# EAGLE design Double Socket (EAGLE 7.4.0)
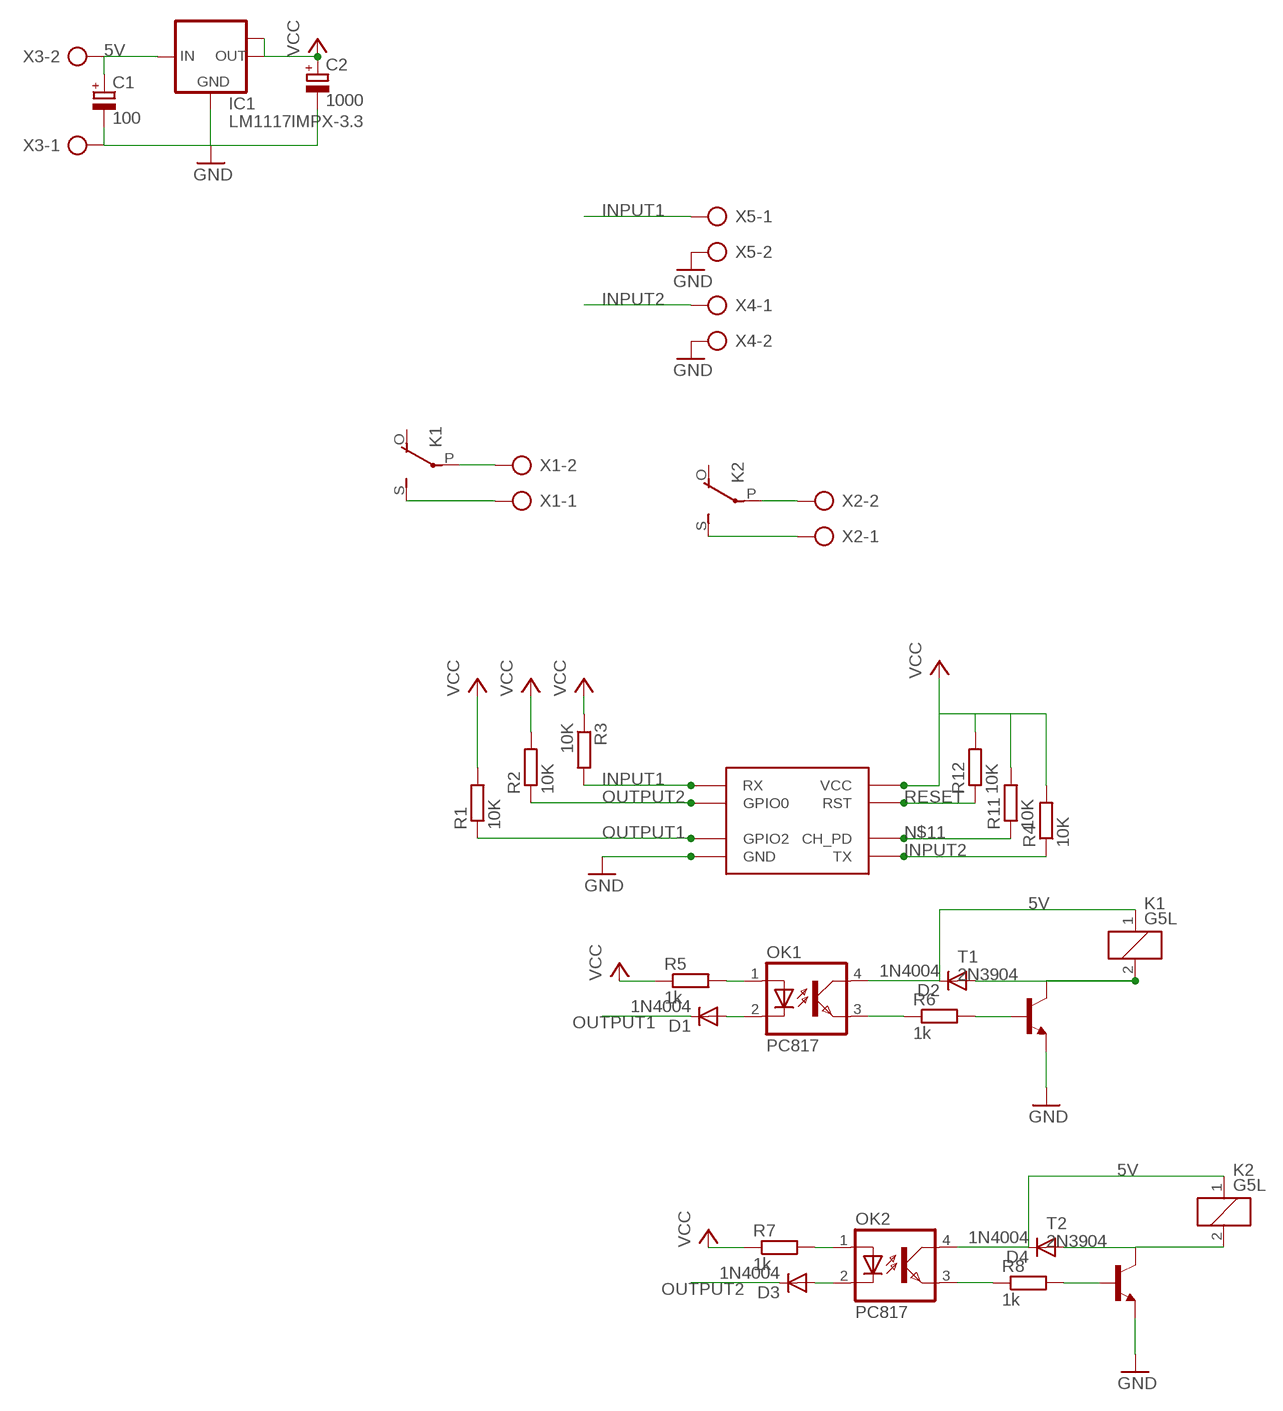
[diagram p0: schematic, sheet 1]

## Parts
C1  100  CPOL-EUE5-10.5  [E5-10,5]
C2  1000  CPOL-EUE5-10.5  [E5-10,5]
D1  1N4004  [DO41-10]
D2  1N4004  [DO41-10]
D3  1N4004  [DO41-10]
D4  1N4004  [DO41-10]
IC1  LM1117IMPX-3.3  [SOT223]
K1  G5L  [G5LE]
K2  G5L  [G5LE]
OK1  PC817  [DIL04]
OK2  PC817  [DIL04]
R1  10K  R-EU_M0805  [M0805]
R2  10K  R-EU_M0805  [M0805]
R3  10K  R-EU_M0805  [M0805]
R4  10K  R-EU_M0805  [M0805]
R5  1k  R-EU_M0805  [M0805]
R6  1k  R-EU_M0805  [M0805]
R7  1k  R-EU_M0805  [M0805]
R8  1k  R-EU_M0805  [M0805]
R11  10K  R-EU_M0805  [M0805]
R12  10K  R-EU_M0805  [M0805]
T1  2N3904  [TO92]
T2  2N3904  [TO92]
U$2  ESP8266  [ESP8266]
X1  AK500/2-H  [AK500/2-H]
X2  AK500/2-H  [AK500/2-H]
X3  AK500/2-H  [AK500/2-H]
X4  AK500/2-H  [AK500/2-H]
X5  AK500/2-H  [AK500/2-H]

## Nets
5V: C1.+ D2.C D4.C IC1.3(IN) K1.1 K2.1 OK1.4(COL) OK2.4(COL) X3.2
GND: C1.- C2.- IC1.1(GND) T1.3(E) T2.3(E) U$2.GND X3.1 X4.2 X5.2
INPUT1: R3.2 U$2.RX X5.1
INPUT2: R4.1 U$2.TX X4.1
N$1: K1.P(2:P) X1.2
N$2: K1.S(2:S) X1.1
N$3: OK1.1(A) R5.2
N$4: OK1.3(EMIT) R6.1
N$5: D1.A OK1.2(C)
N$6: OK2.1(A) R7.2
N$7: R6.2 T1.2(B)
N$8: D2.A K1.2 T1.1(C)
N$9: OK2.3(EMIT) R8.1
N$10: D3.A OK2.2(C)
N$11: R11.1 U$2.CH_PD
N$12: R8.2 T2.2(B)
N$13: D4.A K2.2 T2.1(C)
N$14: K2.S(2:S) X2.1
N$15: K2.P(2:P) X2.2
OUTPUT1: D1.C R1.1 U$2.GPIO2
OUTPUT2: D3.C R2.1 U$2.GPIO0
RESET: R12.1 U$2.RST
VCC: C2.+ IC1.2(OUT) IC1.TAB(OUT1) R1.2 R2.2 R3.1 R4.2 R5.1 R7.1 R11.2 R12.2 U$2.VCC
Unconnected: K1.O(2:O) K2.O(2:O)

## Library data of the parts
C1 C2 = rcl:CPOL-EU: POLARIZED CAPACITOR, European symbol
D1-D4 = diode:1N4004: DIODE general purpose rectifier, 1 A
IC1 = lm1117:LM1117IMPX-*
K1 K2 = relay:G5L: RELAY 1 x switch, 10 A/120 V AC, 8 A/30 V ADC, Omron; OC_FARNELL: unknown; OC_NEWARK: unknown
OK1 OK2 = optocoupler:PC817: SHARP OPTO COUPLER; MPN: PC817X4J000F; OC_FARNELL: 9707727; OC_NEWARK: 97K7059
R1-R8 R11 R12 = rcl:R-EU_: RESISTOR, European symbol
T1 T2 = transistor:2N3904: NPN TRANSISTOR
U$2 = Andre:ESP8266
X1-X5 = con-ptr500:AK500/2-H: CONNECTOR Aug. 2004 / PTR Meßtechnik: Die Bezeichnung der Serie AK505 wurde geändert. Es handelt sich hierbei um AK500 in horizontaler Ausführung.

## Board
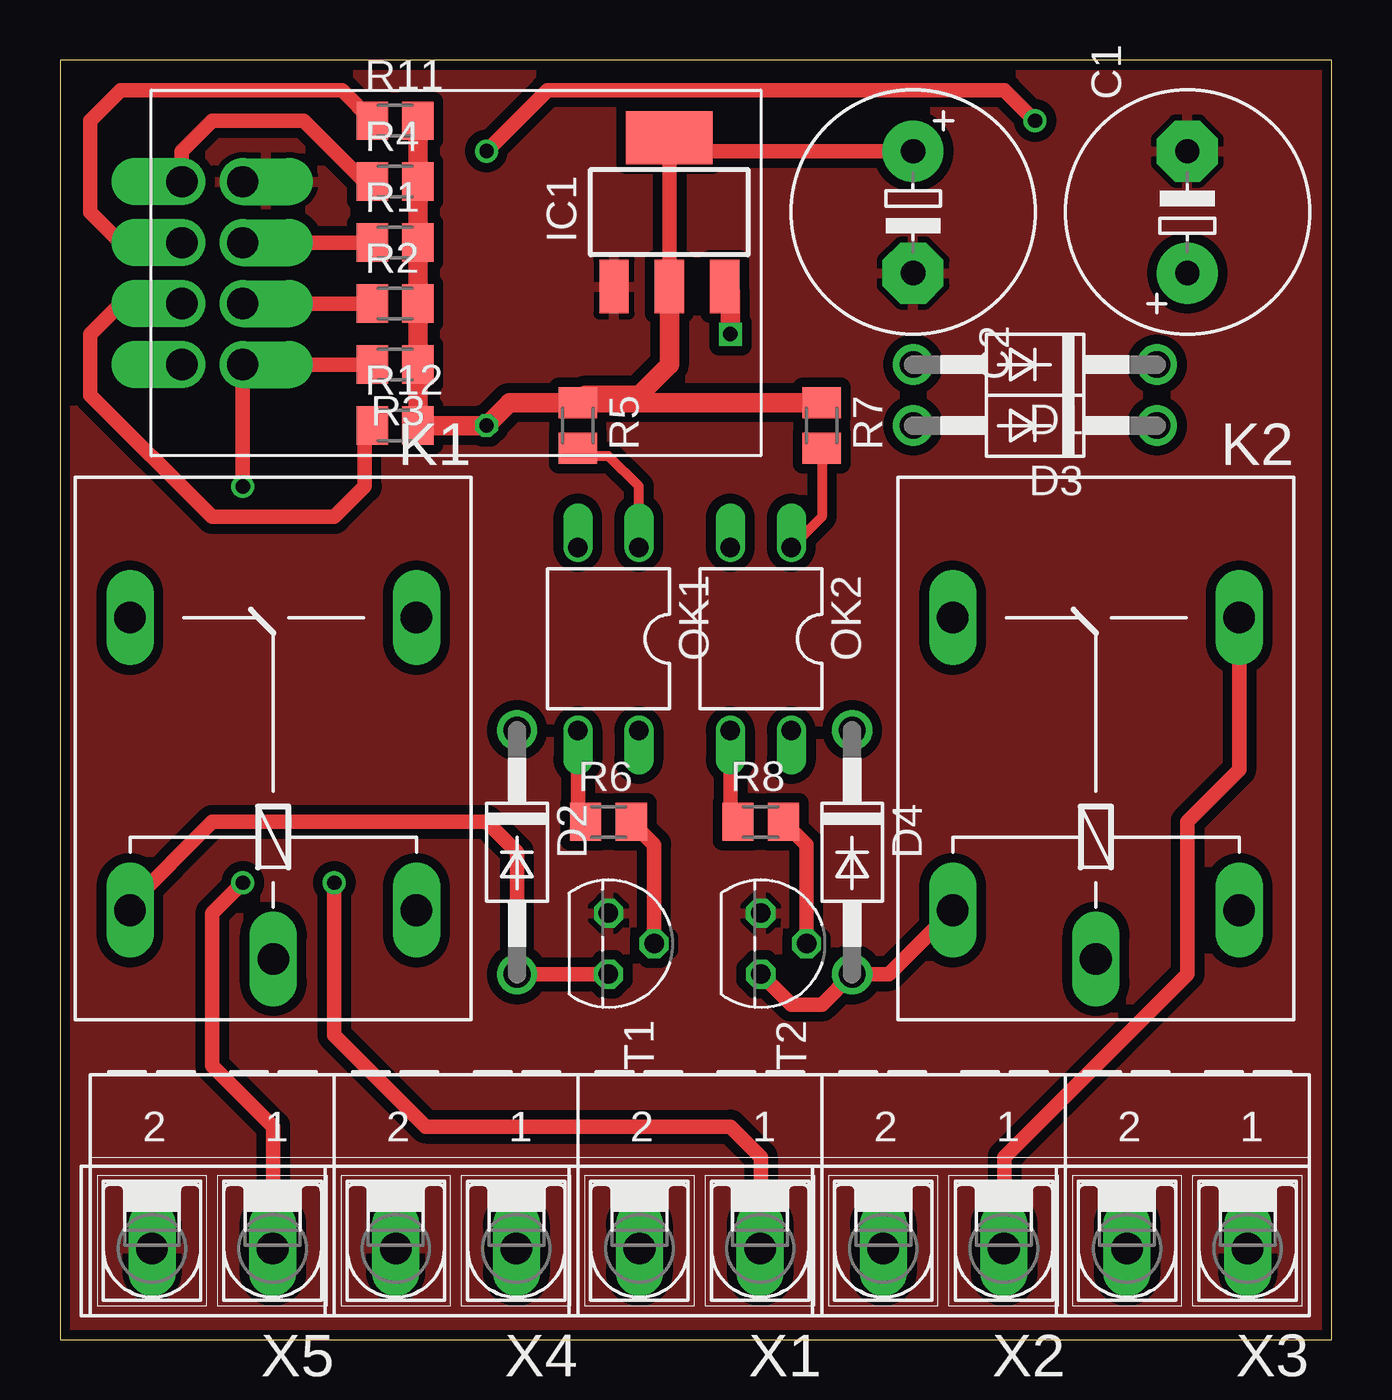
[diagram p1: board, top side]
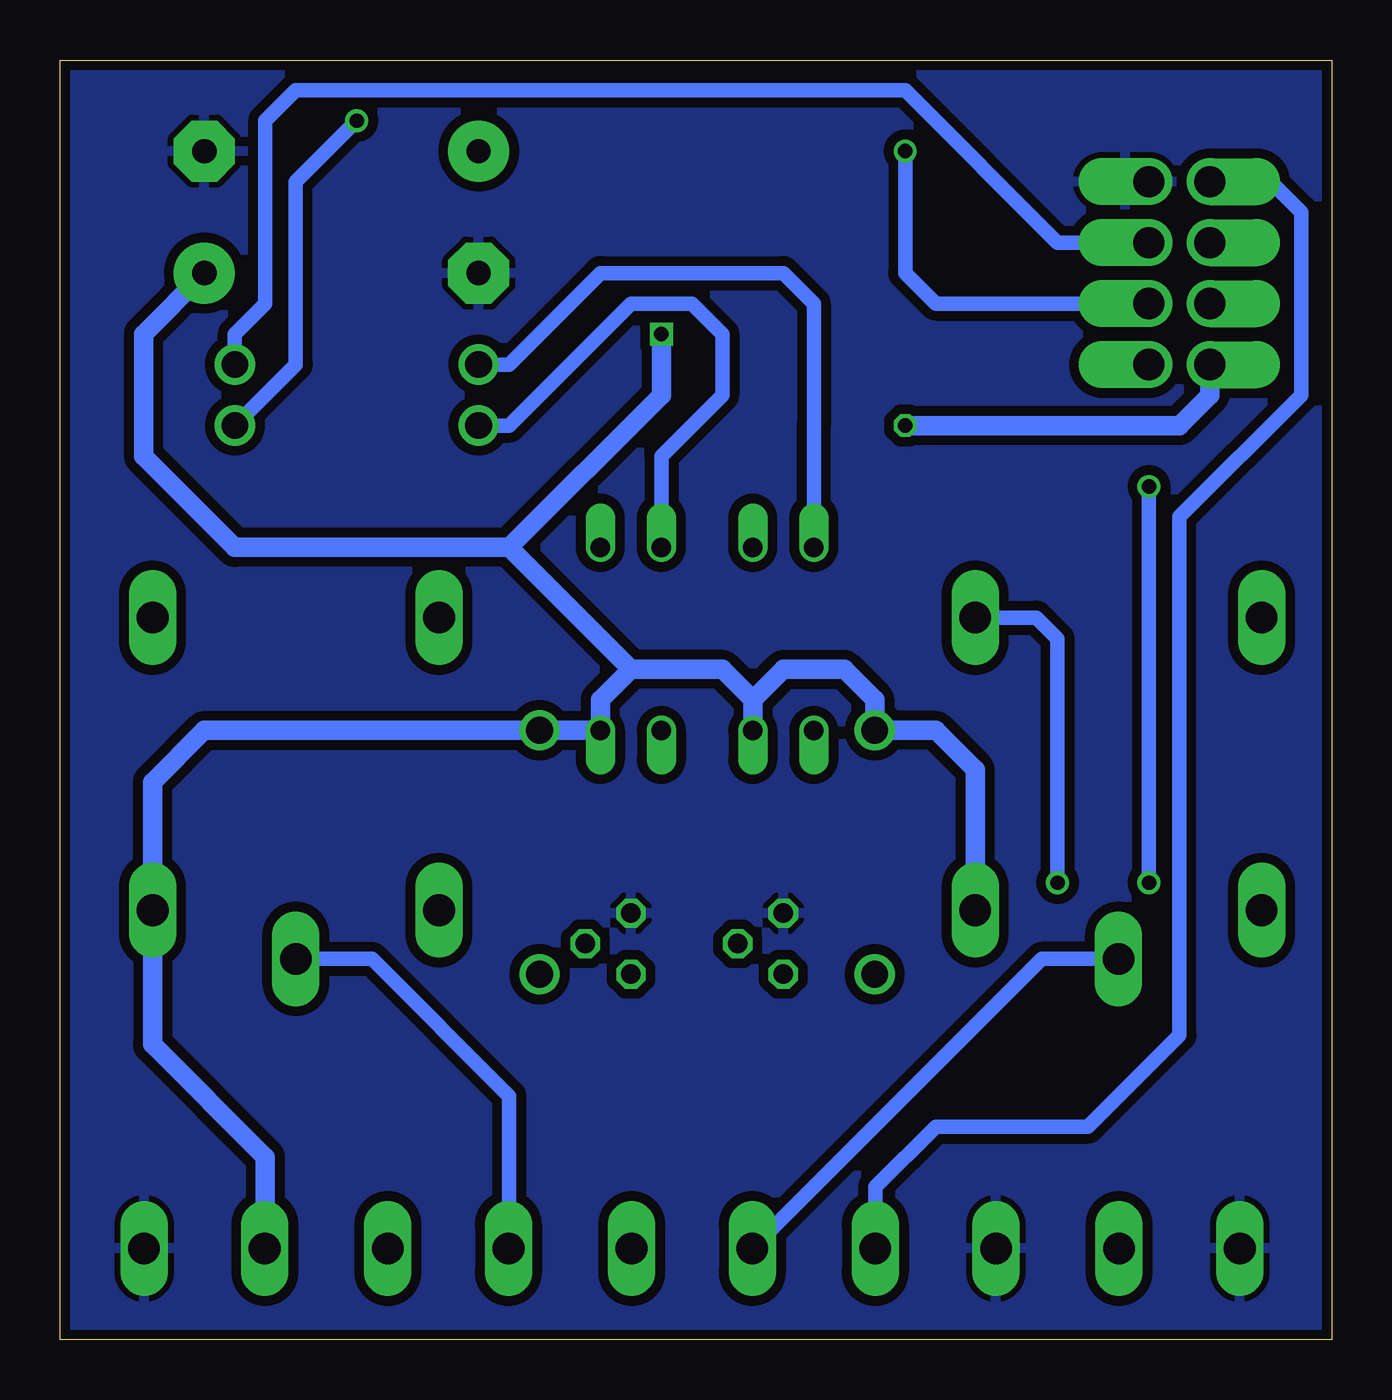
[diagram p2: board, bottom side, seen from below]

Size 53.01 x 53.33 mm. Coordinates in mm from the lower left corner, seen from the top.
Outline: 0,0 53.01,0 53.01,53.33 0,53.33 0,0
Copper layers (1*16): Top 0.0356mm / dielectric 1.5011mm / Bottom 0.0356mm
Design rules "oshpark-2layer": minimum track width 6mil, minimum drill 13mil, track to track 6mil, track to pad 6mil, pad to pad 6mil, via to via 6mil, smd to smd 6mil, copper to edge 15mil, drill to drill 6mil, minimum pad ring 7mil, minimum via ring 7mil, stop-mask expansion 2.5mil, vias tented up to drill 0mil, thermal gap 10mil

### Footprints (pad centres in the part's own frame; a part is rotated, then mirrored left to right if it is on the bottom)
E5-10,5 = drill 1.016 pad 2.54: + -2.54,0 | drill 1.016 pad 2.54 octagon: - 2.54,0
DO41-10 = drill 1.118: A 5.08,0; C -5.08,0
SOT223 = smd 1.219 x 2.235: 1 -2.311,-3.099; 2 0,-3.099; 3 2.311,-3.099 | smd 3.6 x 2.2: TAB 0,3.099
G5LE = drill 1.321 long: 1 -7.493,-5.969; 2 -7.493,5.969; O 4.699,5.969; P -9.525,0; S 4.699,-5.969
DIL04 = drill 0.813 offset: 1 -1.27,-3.81; 2 1.27,-3.81; 3 1.27,3.81; 4 -1.27,3.81
M0805 = smd 1.3 x 1.6: 1 -0.95,0; 2 0.95,0
TO92 = drill 0.813 octagon: 1 1.27,0; 2 0,1.905; 3 -1.27,0
ESP8266 = drill 1.3 offset: CH_PD -1.27,-11.43; GND -3.81,-8.89; GPIO0 1.27,-8.89; GPIO2 -1.27,-8.89; RST 1.27,-11.43; RX 3.81,-8.89; TX -3.81,-11.43; VCC 3.81,-11.43
AK500/2-H = drill 1.321 long: 1 -2.515,0; 2 2.515,0

### Placement (x,y rotation side)
C1  46.99,46.99 90 top
C2  35.56,46.99 270 top
D1  40.64,40.64 180 top
D2  19.05,20.32 270 top
D3  40.64,38.1 180 top
D4  33.02,20.32 270 top
IC1  25.4,46.99 0 top
K1  8.89,25.4 90 top
K2  43.18,25.4 90 top
OK1  22.86,29.21 180 top
OK2  29.21,29.21 180 top
R1  13.97,45.72 0 top
R2  13.97,43.18 0 top
R3  13.97,40.64 180 top
R4  13.97,48.26 0 top
R5  21.59,38.1 270 top
R6  22.86,21.59 0 top
R7  31.75,38.1 270 top
R8  29.21,21.59 0 top
R11  13.97,50.8 0 top
R12  13.97,38.1 0 top
T1  22.86,16.51 270 top
T2  29.21,16.51 270 top
U$2  16.51,44.45 270 top
X1  26.67,3.81 180 top
X2  36.83,3.81 180 top
X3  46.99,3.81 180 top
X4  16.51,3.81 180 top
X5  6.35,3.81 180 top

### Tracks (layer width: path | path; a pad name or v marks a point on that pad's centre or on a via)
5V  (via drill 0.6)
  Top 0.813: v27.94,41.91 27.94,43.66 IC1.3
  Bottom 0.813: X3.2 44.45,3.83 44.45,7.62 49.15,12.32 K2.1 49.15,23.24 46.99,25.4 D4.C OK2.4 30.48,26.67 29.21,27.94 | 24.13,26.67 OK1.4 | 24.13,26.67 25.4,27.94 29.21,27.94 | 24.13,26.67 22.86,27.94 20.32,27.94 19.05,26.67 D2.C 16.51,25.4 14.86,23.75 K1.1 | 29.21,27.94 34.29,33.02 | 34.29,33.02 27.94,39.37 v27.94,41.91 | 34.29,33.02 45.72,33.02 49.53,36.83 49.53,41.91 C1.+
GND
  pour Bottom (isolate 0.406): 0,0 53.34,0 53.34,53.34 0,53.34
  pour Top (isolate 0.406): 0,0 53.34,0 53.34,53.34 0,53.34
INPUT1  (via drill 0.6)
  Top 0.61: R3.2 U$2.RX v7.62,35.56 | v7.62,19.05 6.35,17.78 6.35,11.43 8.89,8.89 8.89,3.83 X5.1
  Bottom 0.61: v7.62,35.56 v7.62,19.05
INPUT2
  Top 0.61: U$2.TX 5.08,49.53 6.35,50.8 10.16,50.8 12.7,48.26 R4.1
  Bottom 0.61: X4.1 19.02,6.38 16.51,8.89 10.16,8.89 6.35,12.7 6.35,34.29 1.27,39.37 1.27,46.99 2.54,48.26 U$2.TX
N$1
  Bottom 0.61: K1.P 12.09,15.88 X1.2
N$2  (via drill 0.6)
  Top 0.61: v11.43,19.05 11.43,12.7 15.24,8.89 27.94,8.89 29.21,7.62 29.21,3.83 X1.1
  Bottom 0.61: K1.S 12.32,30.1 11.43,29.21 v11.43,19.05
N$3
  Top 0.406: OK1.1 24.13,35.56 22.86,36.83 21.91,36.83 R5.2
N$4
  Top 0.61: OK1.3 21.59,21.91 R6.1
N$5
  Bottom 0.61: OK1.2 21.59,36.83 21.59,38.1 21.59,43.18 22.86,44.45 30.48,44.45 34.29,40.64 D1.A
N$6
  Top 0.406: R7.2 31.75,34.29 OK2.1
N$7
  Top 0.61: T1.2 24.77,20.64 R6.2
N$8
  Top 0.61: K1.2 2.92,18.16 6.35,21.59 17.78,21.59 19.05,20.32 D2.A T1.1
N$9
  Top 0.61: OK2.3 27.94,21.91 R8.1
N$10
  Bottom 0.61: D3.A 34.29,38.1 29.21,43.18 26.67,43.18 25.4,41.91 25.4,39.37 27.94,36.83 OK2.2
N$11
  Top 0.61: U$2.CH_PD 2.54,45.72 1.27,46.99 1.27,50.8 2.54,52.07 11.75,52.07 R11.1
N$12
  Top 0.61: T2.2 31.11,20.64 R8.2
N$13
  Top 0.61: K2.2 34.54,15.24 D4.A 31.75,13.97 30.48,13.97 T2.1
N$14
  Top 0.61: K2.S 49.15,23.75 46.99,21.59 46.99,15.24 39.37,7.62 39.37,3.83 X2.1
N$15
  Bottom 0.61: K2.P 40.01,15.88 34.29,10.16 34.29,3.83 X2.2
OUTPUT1
  Top 0.61: U$2.GPIO2 R1.1
  Bottom 0.61: D1.C 45.72,41.91 44.45,43.18 44.45,50.8 43.18,52.07 17.78,52.07 11.43,45.72 U$2.GPIO2
OUTPUT2  (via drill 0.6)
  Top 0.61: U$2.GPIO0 R2.1 | v40.64,50.8 39.37,52.07 20.32,52.07 v17.78,49.53
  Bottom 0.61: D3.C 43.18,40.64 43.18,48.26 v40.64,50.8 | v17.78,49.53 17.78,44.45 16.51,43.18 U$2.GPIO0
RESET
  Top 0.61: U$2.RST 2.54,43.18 1.27,41.91 1.27,39.37 6.35,34.29 11.43,34.29 12.7,35.56 12.7,37.78 R12.1
VCC  (via drill 0.6)
  Top 0.61: C2.+ 25.96,49.53 IC1.TAB IC1.2
  Top 0.813: R11.2 R4.2 R1.2 R2.2 R3.1 R12.2 v17.78,38.1 18.73,39.05 R5.1 | IC1.2 25.4,40.64 24.13,39.37 21.91,39.37 R5.1 | R7.1 R5.1
  Bottom 0.813: U$2.VCC 5.08,39.37 6.35,38.1 v17.78,38.1